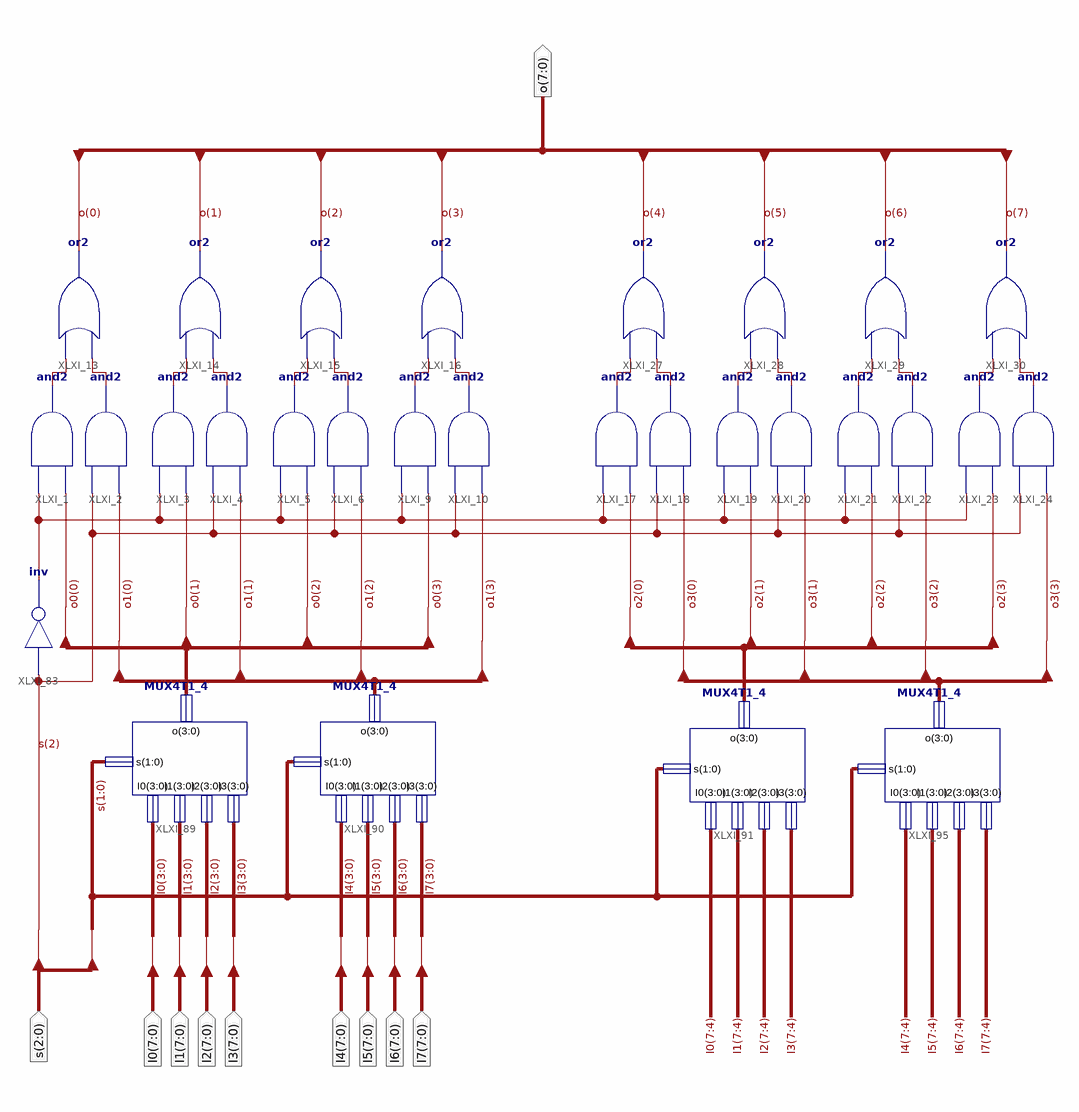
[diagram p0: schematic sheet 1]
// Xilinx ISE schematic MUX8T1_8.sch (kintex7) as structural Verilog: 29 symbols, 10 ports
module MUX8T1_8 (
  input  [2:0] s,
  input  [7:0] I7,
  input  [7:0] I6,
  input  [7:0] I5,
  input  [7:0] I4,
  input  [7:0] I0,
  input  [7:0] I1,
  input  [7:0] I2,
  input  [7:0] I3,
  output [7:0] o
);

  wire XLXN_13, XLXN_14, XLXN_15, XLXN_16, XLXN_17, XLXN_18, XLXN_19, XLXN_20, XLXN_31, XLXN_32, XLXN_33,
       XLXN_34, XLXN_35, XLXN_36, XLXN_37, XLXN_38, XLXN_104;
  wire [3:0] o0, o1, o2, o3;

  and XLXI_1 (XLXN_20, o0[0], XLXN_104);
  and XLXI_2 (XLXN_19, o1[0], s[2]);
  and XLXI_3 (XLXN_18, o0[1], XLXN_104);
  and XLXI_4 (XLXN_17, o1[1], s[2]);
  and XLXI_5 (XLXN_16, o0[2], XLXN_104);
  and XLXI_6 (XLXN_15, o1[2], s[2]);
  and XLXI_9 (XLXN_14, o0[3], XLXN_104);
  and XLXI_10 (XLXN_13, o1[3], s[2]);
  or XLXI_13 (o[0], XLXN_19, XLXN_20);
  or XLXI_14 (o[1], XLXN_17, XLXN_18);
  or XLXI_15 (o[2], XLXN_15, XLXN_16);
  or XLXI_16 (o[3], XLXN_13, XLXN_14);
  and XLXI_17 (XLXN_38, o2[0], XLXN_104);
  and XLXI_18 (XLXN_37, o3[0], s[2]);
  and XLXI_19 (XLXN_36, o2[1], XLXN_104);
  and XLXI_20 (XLXN_35, o3[1], s[2]);
  and XLXI_21 (XLXN_34, o2[2], XLXN_104);
  and XLXI_22 (XLXN_33, o3[2], s[2]);
  and XLXI_23 (XLXN_32, o2[3], XLXN_104);
  and XLXI_24 (XLXN_31, o3[3], s[2]);
  or XLXI_27 (o[4], XLXN_37, XLXN_38);
  or XLXI_28 (o[5], XLXN_35, XLXN_36);
  or XLXI_29 (o[6], XLXN_33, XLXN_34);
  or XLXI_30 (o[7], XLXN_31, XLXN_32);
  not XLXI_83 (XLXN_104, s[2]);
  MUX4T1_4 XLXI_90 (.I0(I4[3:0]), .I1(I5[3:0]), .I2(I6[3:0]), .I3(I7[3:0]), .o(o1), .s(s[1:0]));
  MUX4T1_4 XLXI_89 (.I0(I0[3:0]), .I1(I1[3:0]), .I2(I2[3:0]), .I3(I3[3:0]), .o(o0), .s(s[1:0]));
  MUX4T1_4 XLXI_91 (.I0(I0[7:4]), .I1(I1[7:4]), .I2(I2[7:4]), .I3(I3[7:4]), .o(o2), .s(s[1:0]));
  MUX4T1_4 XLXI_95 (.I0(I4[7:4]), .I1(I5[7:4]), .I2(I6[7:4]), .I3(I7[7:4]), .o(o3), .s(s[1:0]));
endmodule
